# EasyEDA Pro project GEEKS_DEVELOPMENT_BOARD_STM32F4.eprj, schematic Schematic1
Create Date: 2024-09-11; Page Name: P1; Project Name: GEEKS_DEVELOPMENT_BOARD_STM32F4; Schematic Name: Schematic1; Update Date: 2024-10-01; Company: 嘉立创EDA; Page Size: A4; Version: V1.0
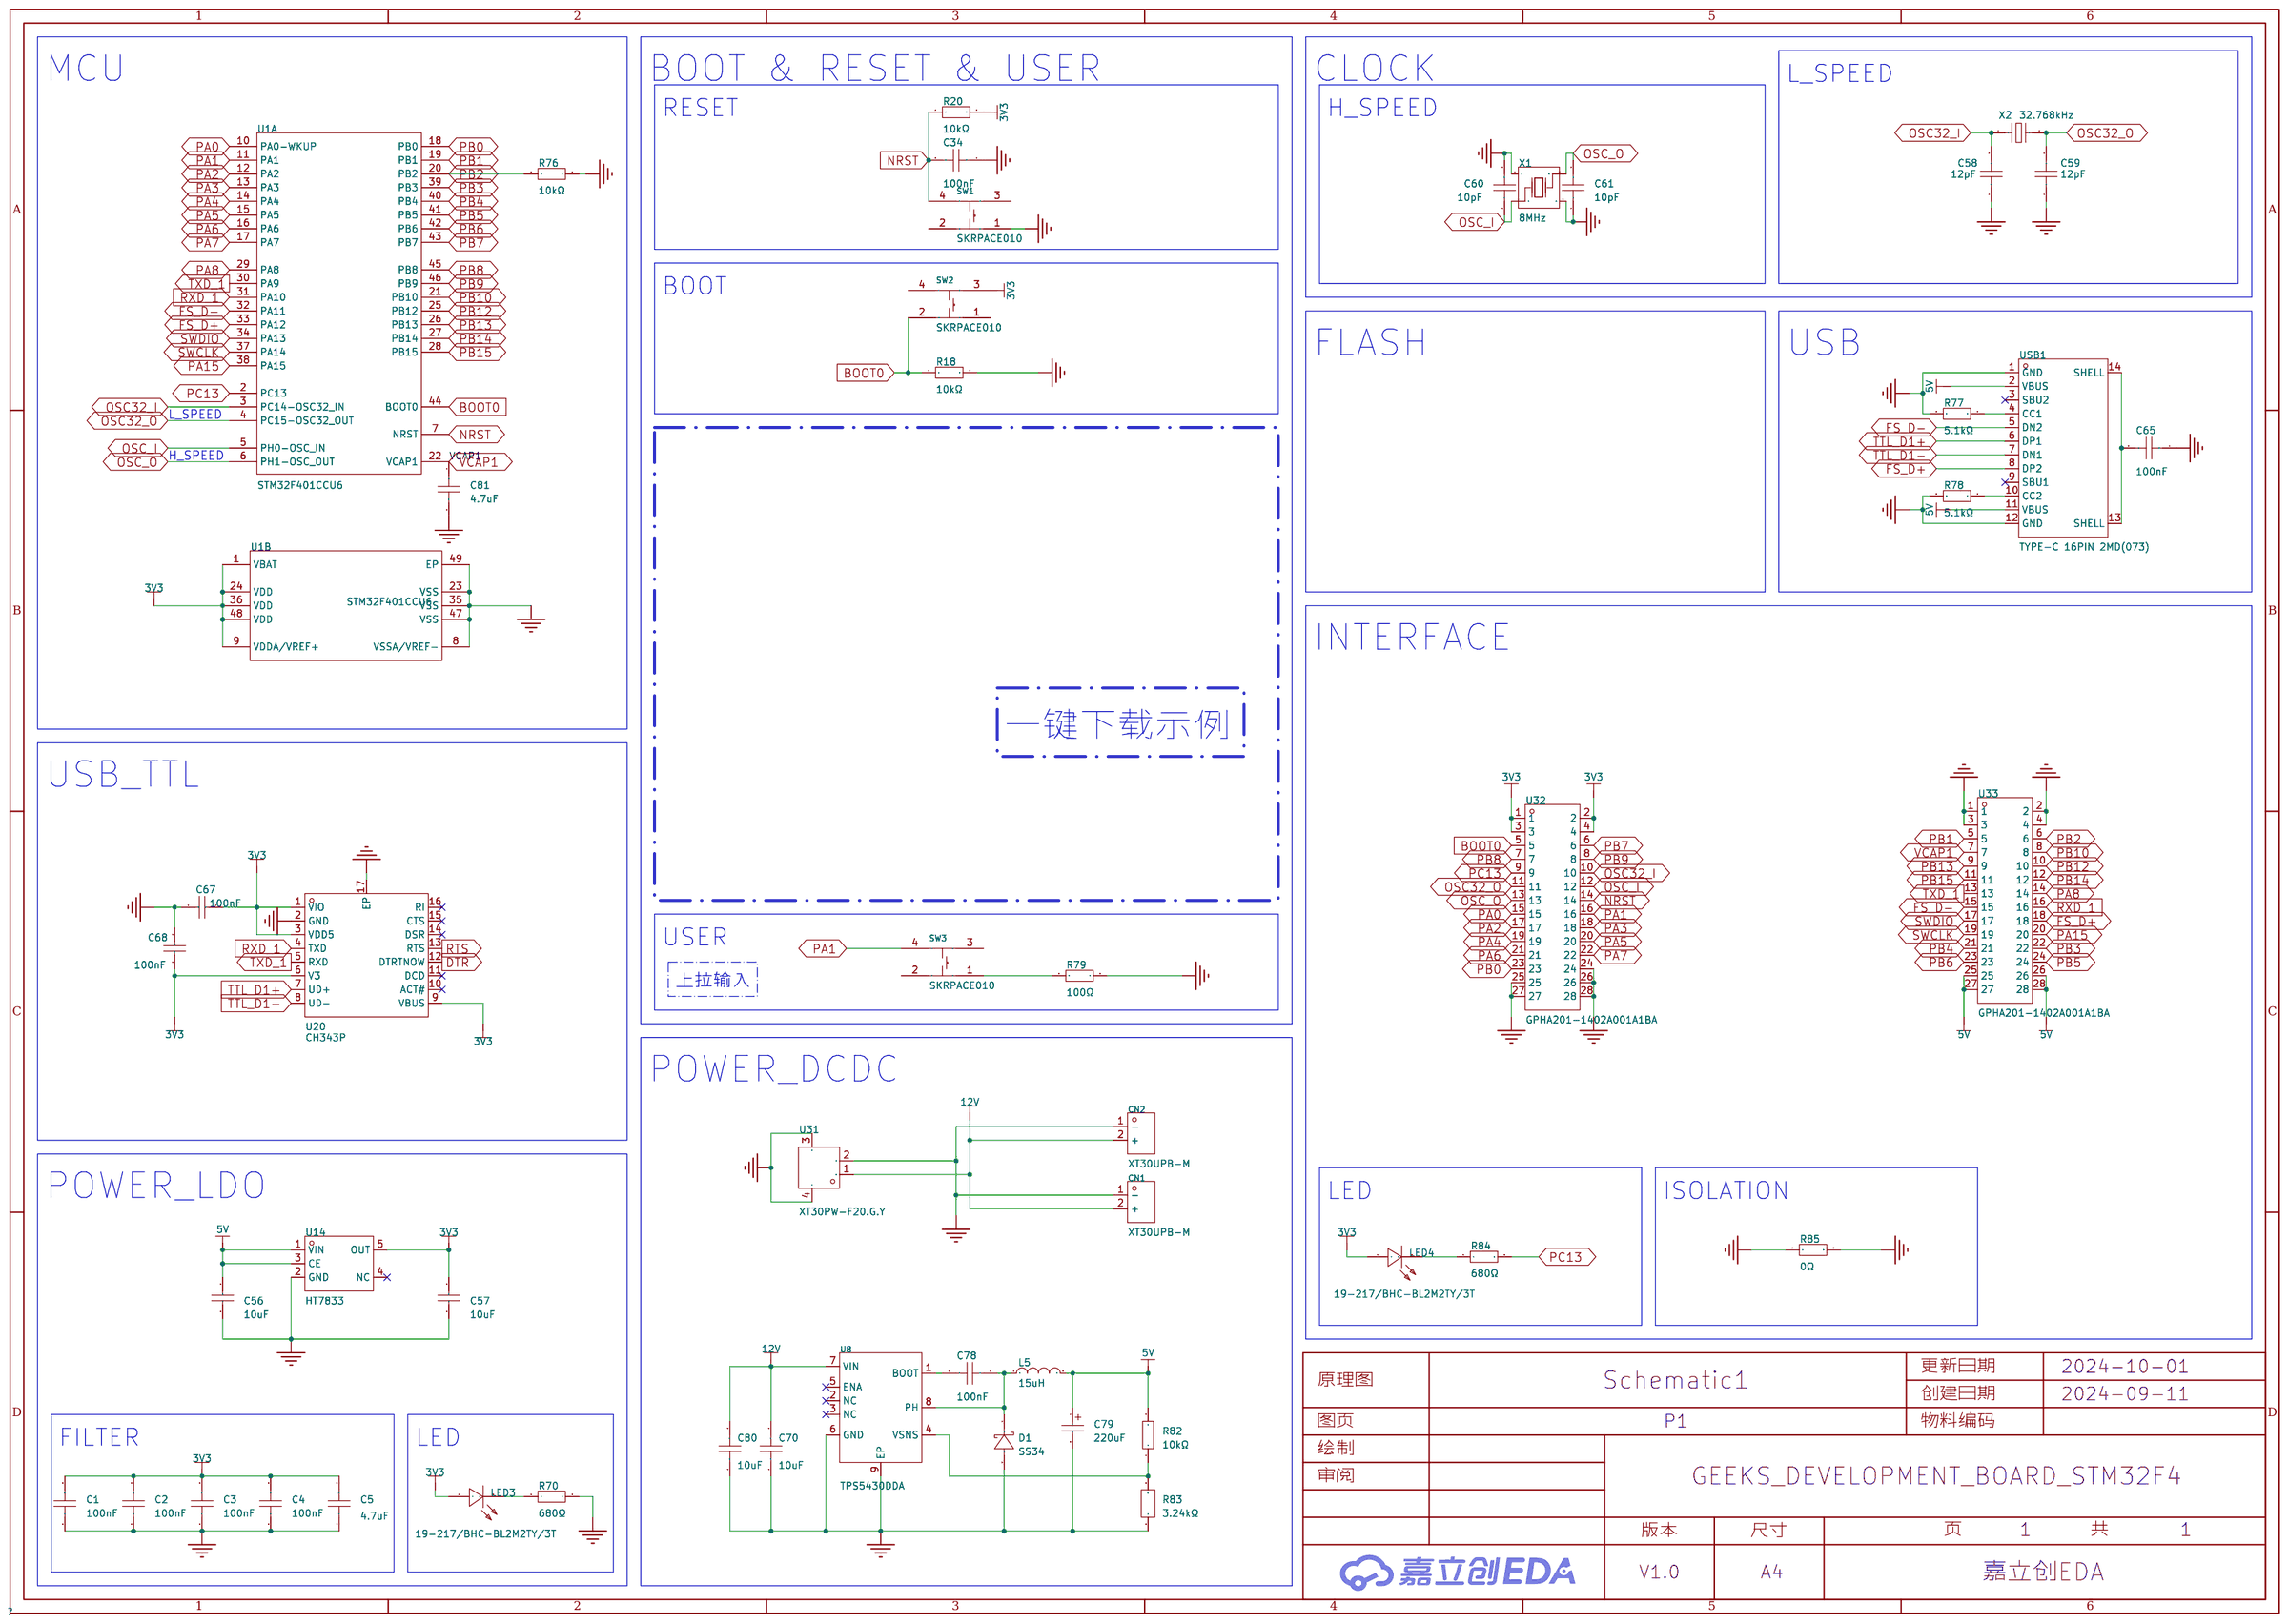
[diagram p0: schematic sheet]

## Parts
C1  100nF  [C0402]
C2  100nF  [C0402]
C3  100nF  [C0402]
C4  100nF  [C0402]
C5  4.7uF  [C0402]
C34  100nF  [C0402]
C56  10uF  [C0402]
C57  10uF  [C0402]
C58  12pF  [C0402]
C59  12pF  [C0402]
C60  10pF  [C0402]
C61  10pF  [C0402]
C65  100nF  [C0402]
C67  100nF  [C0603]
C68  100nF  [C0603]
C70  10uF  [C0603]
C78  100nF  [C0603]
C79  220uF  [CASE-B_3528]
C80  10uF  [C0603]
C81  4.7uF  [C0402]
CN1  XT30UPB-M  [CONN-TH_XT30UPB-M]
CN2  XT30UPB-M  [CONN-TH_XT30UPB-M]
D1  SS34  [SMA_L4.3-W2.5-LS5.0-RD]
L5  15uH  [IND-SMD_L4.6-W4.2_SMMS0420]
LED3  19-217/BHC-BL2M2TY/3T  [LED0603-R-RD_BLUE]
LED4  19-217/BHC-BL2M2TY/3T  [LED0603-R-RD_BLUE]
R18  10kΩ  [R0402]
R20  10kΩ  [R0402]
R70  680Ω  [R0402]
R76  10kΩ  [R0402]
R77  5.1kΩ  [R0402]
R78  5.1kΩ  [R0402]
R79  100Ω  [R0402]
R82  10kΩ  [R0402]
R83  3.24kΩ  [R0402]
R84  680Ω  [R0402]
R85  0Ω  [R0402]
SW1  SKRPACE010  [KEY-SMD_4P-L4.2-W3.2-P2.20-LS4.6]
SW2  SKRPACE010  [KEY-SMD_4P-L4.2-W3.2-P2.20-LS4.6]
SW3  SKRPACE010  [KEY-SMD_4P-L4.2-W3.2-P2.20-LS4.6]
U1  STM32F401CCU6  [UFQFPN-48_L7.0-W7.0-P0.50-BL-EP]  (sections 1,2)
U8  TPS5430DDA  [ESOP-8_L4.9-W3.9-P1.27-LS6.0-BL-EP-2]
U14  HT7833  [SOT-23-5_L2.9-W1.6-P0.95-LS2.8-BL]
U20  CH343P  [TQFN-16_L3.0-W3.0-P0.50-BL-EP1.7]
U31  XT30PW-F20.G.Y  [CONN-TH_XT30PW-F-1]
U32  GPHA201-1402A001A1BA  [HDR-TH_28P-P2.54-V-M-R2-C14-S2.54]
U33  GPHA201-1402A001A1BA  [HDR-TH_28P-P2.54-V-M-R2-C14-S2.54]
USB1  TYPE-C 16PIN 2MD(073)  [USB-C-SMD_TYPE-C-6PIN-2MD-073]
X1  8MHz  [OSC-SMD_4P-L3.2-W2.5-BL]
X2  32.768kHz  [OSC-SMD_L3.2-W1.5]

## Library data of the parts
C1-C4 C65 = GRM155R71H104KE14D: 容值:100nF;精度:±10%;额定电压:50V;材质(温度系数):X7R;; LCSC Part Name: 100nF ±10% 50V; Supplier Part: C77020; Manufacturer: muRata(村田); Supplier Footprint: 0402; JLCPCB Part Class: 扩展库; Datasheet: https://atta.szlcsc.com/upload/public/pdf/source/20180326/C77020_39BD49C951FF1AF0DB1F1FAC5AC1E401.pdf; Supplier: LCSC; Tolerance: ±10%; Voltage Rated: 50V; Temperature Coefficient: X7R
C5 C81 = CL05A475MQ5NRNC: 容值:4.7uF;精度:±20%;额定电压:6.3V;材质(温度系数):X5R;; LCSC Part Name: 4.7uF ±20% 6.3V; Supplier Part: C307423; Manufacturer: SAMSUNG(三星); Supplier Footprint: 0402; JLCPCB Part Class: 扩展库; Datasheet: https://atta.szlcsc.com/upload/public/pdf/source/20181010/C307423_0E0C4E35F3A09F81C2E5C84E00499E42.pdf; Supplier: LCSC; Tolerance: ±20%; Voltage Rated: 6.3V; Temperature Coefficient: X5R
C34 = CC0402JRX7R7BB104: 容值:100nF;精度:±5%;额定电压:16V;材质(温度系数):X7R;; LCSC Part Name: 100nF ±5% 16V; Supplier Part: C541464; Manufacturer: YAGEO(国巨); Supplier Footprint: 0402; JLCPCB Part Class: 扩展库; Datasheet: https://atta.szlcsc.com/upload/public/pdf/source/20200615/C541464_B57AABC9570B6B2CE091E735F96B12C0.pdf; Supplier: LCSC; Tolerance: ±5%; Voltage Rated: 16V; Temperature Coefficient: X7R
C56 C57 = CL05A106MQ5NUNC: 容值:10uF;精度:±20%;额定电压:6.3V;材质(温度系数):X5R;; LCSC Part Name: 10uF ±20% 6.3V; Supplier Part: C15525; Manufacturer: SAMSUNG(三星); Supplier Footprint: 0402; JLCPCB Part Class: 基础库; Datasheet: https://atta.szlcsc.com/upload/public/pdf/source/20220823/2B02EE04F8F211D38A52DCB16EB6BEBA.pdf; Supplier: LCSC; Tolerance: ±20%; Voltage Rated: 6.3V; Temperature Coefficient: X5R
C58 C59 = GCM1555C1H120FA16D: 容值:12pF;精度:±1%;额定电压:50V;材质(温度系数):C0G;; LCSC Part Name: 12pF ±1% 50V; Supplier Part: C393682; Manufacturer: muRata(村田); Supplier Footprint: 0402; JLCPCB Part Class: 扩展库; Datasheet: https://atta.szlcsc.com/upload/public/pdf/source/20190516/C393682_2405B7553F1D74F0F214F12B2CF6E34B.pdf; Supplier: LCSC; Tolerance: ±1%; Voltage Rated: 50V; Temperature Coefficient: C0G
C60 C61 = CL05C100JB5NNNC: 容值:10pF;精度:±5%;额定电压:50V;材质(温度系数):C0G;; LCSC Part Name: 10pF ±5% 50V; Supplier Part: C32949; Manufacturer: SAMSUNG(三星); Supplier Footprint: 0402; JLCPCB Part Class: 基础库; Datasheet: https://atta.szlcsc.com/upload/public/pdf/source/20160218/1457707763339.pdf; Supplier: LCSC; Tolerance: ±5%; Voltage Rated: 50V; Temperature Coefficient: C0G
C67 C68 = 0603B104K500NT: 容值:100nF;精度:±10%;额定电压:50V;材质(温度系数):X7R;; LCSC Part Name: 100nF ±10% 50V; Supplier Part: C30926; Manufacturer: FH(风华); Supplier Footprint: 0603; JLCPCB Part Class: 扩展库; Datasheet: https://atta.szlcsc.com/upload/public/pdf/source/20200305/C486355_26A10D38EF8C2A5C37091D0039909270.pdf; Supplier: LCSC; Tolerance: ±10%; Voltage Rated: 50V; Temperature Coefficient: X7R
C70 C80 = CL10A106KP8NNNC: 容值:10uF;精度:±10%;额定电压:10V;材质(温度系数):X5R;; LCSC Part Name: 10uF ±10% 10V; Supplier Part: C19702; Manufacturer: SAMSUNG(三星); Supplier Footprint: 0603; JLCPCB Part Class: 基础库; Datasheet: https://atta.szlcsc.com/upload/public/pdf/source/20160218/1457707763339.pdf; Supplier: LCSC; Tolerance: ±10%; Voltage Rated: 10V; Temperature Coefficient: X5R
C78 = CGA0603X7R104K500JT: 容值:100nF;精度:±10%;额定电压:50V;材质(温度系数):X7R;; LCSC Part Name: 100nF ±10% 50V; Supplier Part: C6119867; Manufacturer: HRE(芯声); Supplier Footprint: 0603; JLCPCB Part Class: 扩展库; Supplier: LCSC; Tolerance: ±10%; Voltage Rated: 50V; Temperature Coefficient: X7R
C79 = TLJB227M006R0500: 容值:220uF;精度:±20%;额定电压:6.3V;等效串联电阻:500mΩ@100kHz;; LCSC Part Name: 220uF ±20% 6.3V; Supplier Part: C30242; Manufacturer: Kyocera AVX; Supplier Footprint: CASE-B-3528; JLCPCB Part Class: 扩展库; Datasheet: https://atta.szlcsc.com/upload/public/pdf/source/20181016/C313517_95E099C94D57B8A6005DAF15C3058A23.pdf; Supplier: LCSC; Tolerance: ±20%; Rated Voltage: 6.3V; Equivalent Series Resistance(ESR): 500mΩ@100kHz; Operating Temperature: -55℃~+125℃
CN1 CN2 = XT30UPB-M: 类别:-;类型1:-;; LCSC Part Name: AMASS(艾迈斯)板载立式 航模锂电池控制器连接器插头 公头XT30UPB-M; Supplier Part: C428721; Manufacturer: AMASS(艾迈斯); JLCPCB Part Class: 扩展库; Datasheet: https://atta.szlcsc.com/upload/public/pdf/source/20230412/7B5DFEF57C9EA5273853390C734B3AC5.pdf; Supplier: LCSC; Brand: 艾迈斯; Type: 航模插头; Colour: 黄色; RatedVoltage: DC 500V; InterfaceType: 公头; MetalMaterial: 镀金; InsulationMaterial: PA; RatedCurrent: 15A; contact resistance: 0.65mΩ
D1 = SS34_C727060: 二极管配置:独立式;正向压降(Vf):550mV@3A;直流反向耐压(Vr):40V;平均整流电流(Io):3A;; LCSC Part Name: 电压:40V 电流:3A; Supplier Part: C727060; Manufacturer: TWGMC(台湾迪嘉); Supplier Footprint: SMA(DO-214AC); JLCPCB Part Class: 扩展库; Datasheet: https://atta.szlcsc.com/upload/public/pdf/source/20200828/C727059_6599B6CAC5F3238B9C33E46794659DBE.pdf; Supplier: LCSC; Diode Configuration: 独立式; Forward Voltage (Vf@If): 550mV@3A; Reverse Voltage (Vr): 40V; Average Rectified Current (Io): 3A; Reverse Leakage Current (Ir): 500uA@40V
L5 = SMMS0420-150M: 电感值:15uH;精度:±20%;额定电流:1.4A;饱和电流(Isat):1.9A;类型:一体成型电感;; LCSC Part Name: 15uH ±20% 1.9A; Supplier Part: C2894719; Manufacturer: SXN(顺翔诺); Supplier Footprint: SMD,4.6x4.2x2mm; JLCPCB Part Class: 扩展库; Datasheet: https://atta.szlcsc.com/upload/public/pdf/source/20210910/523B6BB0C4A09F37806A127B1ABE761D.pdf; Supplier: LCSC; Tolerance: ±20%; Rated Current: 1.4A; Saturation Current (Isat): 1.9A; DC Resistance (DCR): 320mΩ; Type: 一体成型电感
LED3 LED4 = 19-217/BHC-BL2M2TY/3T: 发光颜色:蓝灯;; LCSC Part Name: 蓝灯; Supplier Part: C264471; Manufacturer: EVERLIGHT(亿光); Supplier Footprint: 0603; Datasheet: https://atta.szlcsc.com/upload/public/pdf/source/20190115/C264471_53BC758422C9CC53D26B857C95585990.pdf; Supplier: LCSC; Emitted Color: 蓝灯
R18 R20 = RC0402FR-0710KL: 电阻类型:厚膜电阻;阻值:10kΩ;精度:±1%;功率:62.5mW;; LCSC Part Name: 10kΩ ±1% 62.5mW; Supplier Part: C60490; Manufacturer: YAGEO(国巨); Supplier Footprint: 0402; JLCPCB Part Class: 扩展库; Datasheet: https://atta.szlcsc.com/upload/public/pdf/source/20170606/1496716515432.pdf; Supplier: LCSC; Type: 厚膜电阻; Tolerance: ±1%; Power(Watts): 62.5mW; Overload Voltage (Max): 50V; Temperature Coefficient: ±100ppm/℃; Operating Temperature Range: -55℃~+155℃
R70 R84 = 0402WGF6800TCE: 电阻类型:厚膜电阻;阻值:680Ω;精度:±1%;功率:62.5mW;最大工作电压:50V;温度系数:±100ppm/℃;; LCSC Part Name: 680Ω ±1% 62.5mW 厚膜电阻; Supplier Part: C25130; Manufacturer: UNI-ROYAL(厚声); Supplier Footprint: 0402; JLCPCB Part Class: 扩展库; Datasheet: https://atta.szlcsc.com/upload/public/pdf/source/20200306/C422600_1E6D84923E4A46A82E41ADD87F860B5C.pdf; Supplier: LCSC; Type: 厚膜电阻; Tolerance: ±1%; Power(Watts): 62.5mW; Overload Voltage (Max): 50V; Temperature Coefficient: ±100ppm/℃; Operating Temperature Range: -55℃~+155℃
R76 = RC0402FR-0710KL: 电阻类型:厚膜电阻;阻值:10kΩ;精度:±1%;功率:62.5mW;最大工作电压:50V;温度系数:±100ppm/℃;; LCSC Part Name: 厚膜电阻 10kΩ ±1% 62.5mW; Supplier Part: C60490; Manufacturer: YAGEO(国巨); Supplier Footprint: 0402; JLCPCB Part Class: 扩展库; Datasheet: https://atta.szlcsc.com/upload/public/pdf/source/20170925/C131467_1506321478108990263.pdf; Supplier: LCSC; Type: 厚膜电阻; Tolerance: ±1%; Power(Watts): 62.5mW; Overload Voltage (Max): 50V; Temperature Coefficient: ±100ppm/℃; Operating Temperature Range: -55℃~+155℃
R77 R78 = 0402WGF5101TCE: 电阻类型:厚膜电阻;阻值:5.1kΩ;精度:±1%;功率:62.5mW;最大工作电压:50V;温度系数:±100ppm/℃;; LCSC Part Name: 5.1kΩ ±1% 62.5mW 厚膜电阻; Supplier Part: C25905; Manufacturer: UNI-ROYAL(厚声); Supplier Footprint: 0402; JLCPCB Part Class: 基础库; Datasheet: https://atta.szlcsc.com/upload/public/pdf/source/20200306/C422600_1E6D84923E4A46A82E41ADD87F860B5C.pdf; Supplier: LCSC; Type: 厚膜电阻; Tolerance: ±1%; Power(Watts): 62.5mW; Overload Voltage (Max): 50V; Temperature Coefficient: ±100ppm/℃; Operating Temperature Range: -55℃~+155℃
R79 = 0402WGJ0101TCE: 电阻类型:厚膜电阻;阻值:100Ω;精度:±5%;功率:62.5mW;最大工作电压:50V;温度系数:±100ppm/℃;; LCSC Part Name: 100Ω ±5% 62.5mW 厚膜电阻; Supplier Part: C25138; Manufacturer: UNI-ROYAL(厚声); Supplier Footprint: 0402; JLCPCB Part Class: 扩展库; Datasheet: https://atta.szlcsc.com/upload/public/pdf/source/20200306/C422600_1E6D84923E4A46A82E41ADD87F860B5C.pdf; Supplier: LCSC; Type: 厚膜电阻; Tolerance: ±5%; Power(Watts): 62.5mW; Overload Voltage (Max): 50V; Temperature Coefficient: ±100ppm/℃; Operating Temperature Range: -55℃~+155℃
R82 = 0402WGF1002TCE: 电阻类型:厚膜电阻;阻值:10kΩ;精度:±1%;功率:62.5mW;最大工作电压:50V;温度系数:±100ppm/℃;; LCSC Part Name: 10kΩ ±1% 62.5mW 厚膜电阻; Supplier Part: C25744; Manufacturer: UNI-ROYAL(厚声); Supplier Footprint: 0402; JLCPCB Part Class: 基础库; Datasheet: https://atta.szlcsc.com/upload/public/pdf/source/20200306/C422600_1E6D84923E4A46A82E41ADD87F860B5C.pdf; Supplier: LCSC; Type: 厚膜电阻; Tolerance: ±1%; Power(Watts): 62.5mW; Overload Voltage (Max): 50V; Temperature Coefficient: ±100ppm/℃; Operating Temperature Range: -55℃~+155℃
R83 = PTFR0402B3K24N9: 电阻类型:薄膜电阻;阻值:3.24kΩ;精度:±0.1%;功率:60mW;最大工作电压:75V;温度系数:±10ppm/℃;; LCSC Part Name: 薄膜电阻 3.24kΩ ±0.1% 60mW; Supplier Part: C2692977; Manufacturer: RESI(开步睿思); Supplier Footprint: 0402; JLCPCB Part Class: 扩展库; Datasheet: https://atta.szlcsc.com/upload/public/pdf/source/20240506/11BDC7478D84177AC2A5326A65B6EB29.pdf; Supplier: LCSC; Type: 薄膜电阻; Tolerance: ±0.1%; Power(Watts): 60mW; Overload Voltage (Max): 75V; Temperature Coefficient: ±10ppm/℃; Operating Temperature Range: -55℃~+125℃
R85 = 0402WGF0000TCE: 电阻类型:厚膜电阻;阻值:0Ω;精度:±1%;功率:62.5mW;最大工作电压:50V;温度系数:±800ppm/℃;; LCSC Part Name: 0Ω ±1% 62.5mW 厚膜电阻; Supplier Part: C17168; Manufacturer: UNI-ROYAL(厚声); Supplier Footprint: 0402; JLCPCB Part Class: 基础库; Datasheet: https://atta.szlcsc.com/upload/public/pdf/source/20200306/C422600_1E6D84923E4A46A82E41ADD87F860B5C.pdf; Supplier: LCSC; Type: 厚膜电阻; Tolerance: ±1%; Power(Watts): 62.5mW; Overload Voltage (Max): 50V; Temperature Coefficient: ±800ppm/℃; Operating Temperature Range: -55℃~+155℃
SW1-SW3 = SKRPACE010: 电路结构:单刀单掷;按钮形状:椭圆形按钮;安装方式:立贴;开关长度:4.2mm;开关宽度:3.2mm;开关高度:2.5mm;触点电流:50mA;额定电压(DC):16V;带灯:-;机械寿命:-;; LCSC Part Name: 4.2*3.2*2.5mm 立贴 轻触开关; Supplier Part: C139797; Manufacturer: ALPSALPINE(阿尔卑斯阿尔派); Supplier Footprint: SMD; JLCPCB Part Class: 扩展库; Datasheet: https://atta.szlcsc.com/upload/public/pdf/source/20171113/C139797_15105612676371115729.pdf; Supplier: LCSC; Circuit: 单刀单掷; Actuator Style: 椭圆形按钮; Mounting Style: 立贴; Switch Length: 4.2mm; Switch Width: 3.2mm; Switch Height: 2.5mm; Contact Current: 50mA; Voltage Rating (DC): 16V
U1 = STM32F401CCU6: CPU内核:ARM-M4;程序存储容量:256KB;RAM总容量:64KB;GPIO端口数量:36;工作电压范围:1.7V~3.6V;CPU最大主频:84MHz;程序存储器类型:FLASH;; LCSC Part Name: 带DSP和FPU的高性能基本型系列ARM Cortex-M4 MCU，具有256 KB Flash、84 MHz CPU和ART加速器; Supplier Part: C79861; Manufacturer: ST(意法半导体); Supplier Footprint: UFQFPN-48(7x7); JLCPCB Part Class: 扩展库; Datasheet: https://atta.szlcsc.com/upload/public/pdf/source/20160816/1471343009422.pdf; Supplier: LCSC; CPU Core: ARM-M4; Program Storage Size: 256KB; RAM Size: 64KB; GPIO Ports Number: 36; Operating Voltage Range: 1.7V~3.6V; CPU Maximum Speed: 84MHz; Program Memory Type: FLASH; Operating Temperature Range: -40℃~+85℃; ADC (Bit): 12bit; Universal Serial Bus: 有; Peripheral/Function: PWM；PWM; Secure Digital Input and Output: 有; Internal Oscillator: 有
U8 = TPS5430DDA: 功能类型:降压型;输出类型:可调;输入电压:5.5V~36V;输出电压:1.221V~32.04V;输出电流(最大值):3A;; Supplier Part: C502477; Manufacturer: TI(德州仪器); Supplier Footprint: SOP-8-EP; JLCPCB Part Class: 扩展库; Datasheet: https://www.ti.com/cn/lit/gpn/tps5430; Supplier: LCSC; Function: 降压型; Synchronous Rectification: 否; Output Type: 可调; Number of Outputs: 1; Topology: 降压式; Input Voltage: 5.5V~36V; Output Voltage: 1.221V~32.04V; Output Current (Max): 3A; Switching Frequency: 500kHz; Operating Temperature: -40℃~+125℃@(TJ)
U14 = HT7833_C3011187: LCSC Part Name: 500mA 2uA Hight PSRR Voltage Regulator; Supplier Part: C3011187; Manufacturer: TECH PUBLIC(台舟); Supplier Footprint: SOT-23-5; JLCPCB Part Class: 扩展库; Datasheet: https://atta.szlcsc.com/upload/public/pdf/source/20220511/52D8A72EC3CBC44D368221752E30E118.pdf; Supplier: LCSC
U20 = CH343P: 应用功能:-;接口协议:-;; Supplier Part: C2846043; Manufacturer: WCH(南京沁恒); Supplier Footprint: TQFN-16-EP(3x3); JLCPCB Part Class: 扩展库; Datasheet: https://atta.szlcsc.com/upload/public/pdf/source/20211010/C2846043_7FA705E1F14A2906F6A2AFA45FA28209.pdf; Supplier: LCSC
U31 = XT30PW-F20.G.Y: 类别:-;类型1:-;; LCSC Part Name: AMASS(艾迈斯)电源连接器 母头 XT30PW-F; Supplier Part: C2913282; Manufacturer: AMASS(艾迈斯); JLCPCB Part Class: 扩展库; Datasheet: https://atta.szlcsc.com/upload/public/pdf/source/20231218/06CFCF98887A9A87638B0856A725C8FD.pdf; Supplier: LCSC; Type: 航模插头; InterfaceType: 母头
U32 U33 = GPHA201-1402A001A1BA: 插针结构:2x14P;间距:2.54mm;行距:2.54mm;圆针/方针:方针;安装类型:直插;排数:双排;总PIN位数:28P;额定电流:3A;工作温度范围:-40℃~+105℃;; LCSC Part Name: 2x14P 间距:2.54mm 方针 直插; Supplier Part: C7434507; Manufacturer: GREENCONN(格康); Supplier Footprint: 插件,P=2.54mm; JLCPCB Part Class: 扩展库; Datasheet: https://atta.szlcsc.com/upload/public/pdf/source/20230629/613DF7C618537BFD465DA32CACFAE383.pdf; Supplier: LCSC; Pin Structure: 2x14P; Pitch: 2.54mm; Row Spacing: 2.54mm; Circluar Pins/Square Pins: 方针; Mounting Type: 直插; Number of Rows: 双排; Number of Pins: 28P; Current Rating (Max): 3A; Operating Temperature Range: -40℃~+105℃
USB1 = TYPE-C 16PIN 2MD(073): 连接器类型:Type-C;标准:USB 3.1;公母:母;安装方式:卧贴;触点数量:16P;端口数量:1;额定电流 - 电源:5A;工作温度范围:-25℃~+85℃;; LCSC Part Name: Type-C 母 卧贴; Supplier Part: C2765186; Manufacturer: SHOU HAN(首韩); Supplier Footprint: SMD; JLCPCB Part Class: 扩展库; Datasheet: https://atta.szlcsc.com/upload/public/pdf/source/20211123/39B17C16241EAC15C5E277BDA434118E.pdf; Supplier: LCSC; Connector Type: Type-C; Standard: USB 3.1; Gender: 母; Mounting Style: 卧贴; Number of Contacts: 16P; Number of Ports: 1; Current Rating - Power (Max): 5A; Operating Temperature Range: -25℃~+85℃; Rated Voltage (Max): 5V; Connect-Disconnect Life: 5千次; Core Colour: 黑色
X1 = TAXM8M4RDBCCT2T: 晶振类型:贴片晶振;频率:8MHz;常温频差:±10ppm;外接负载电容:10pF;频率稳定度(全温):±15ppm;; LCSC Part Name: 8MHz ±10ppm 10pF; Supplier Part: C400090; Manufacturer: YJX(雅晶鑫); Supplier Footprint: SMD3225-4P; JLCPCB Part Class: 扩展库; Datasheet: https://atta.szlcsc.com/upload/public/pdf/source/20190626/C400090_CF95B89E745AFE4EF2E392EF8AC009D6.pdf; Supplier: LCSC; Crystal Type: 贴片晶振; Normal temperature Frequency Tolerance: ±10ppm; External load capacitor: 10pF; Frequency Stability(Full temperature range): ±15ppm; Equivalent Series Resistance (ESR): 250Ω; Operating Temperature: -40℃~+85℃
X2 = X321532768KGD2SI: 晶振类型:贴片晶振;频率:32.768kHz;常温频差:±20ppm;外接负载电容:12.5pF;频率稳定度(全温):-;; LCSC Part Name: 32.768kHz ±20ppm 12.5pF; Supplier Part: C620155; Manufacturer: YXC(扬兴晶振); Supplier Footprint: SMD3215-2P; JLCPCB Part Class: 扩展库; Datasheet: https://atta.szlcsc.com/upload/public/pdf/source/20240329/3A7650FD985DD0DE85694D3785AB4916.pdf; Supplier: LCSC; Crystal Type: 贴片晶振; Normal temperature Frequency Tolerance: ±20ppm; External load capacitor: 12.5pF; Operating Temperature: -40℃~+85℃

## Nets
3V3: C1.2 C2.2 C3.2 C4.2 C5.2 C57.2 C67.2 C68.1 LED3.1(A) LED4.1(A) R20.2 SW2.3 U1.1(VBAT) U1.9(VDDA/VREF+) U1.24(VDD) U1.36(VDD) U1.48(VDD) U14.5(OUT) U20.1(VIO) U20.3(VDD5) U20.6(V3) U20.9(VBUS) U32.1 U32.2 U32.3 U32.4
5V: C56.2 C79.1 L5.2 R82.2 U14.1(VIN) U14.3(CE) U33.25 U33.26 U33.27 U33.28 USB1.2(VBUS) USB1.11(VBUS)
12V: C70.2 C80.2 CN1.2(+) CN2.2(+) U8.7(VIN) U31.1
AGND: C70.1 C79.2 C80.1 CN1.1(-) CN2.1(-) D1.2(A) R83.1 R85.2 U8.6(GND) U8.9(EP) U31.2 U31.3 U31.4
GND: C1.1 C2.1 C3.1 C4.1 C5.1 C34.1 C56.1 C57.1 C58.1 C59.1 C60.2 C61.1 C65.1 C67.1 C68.2 C81.2 R18.2 R70.2 R76.2 R77.2 R78.2 R79.1 R85.1 SW1.1 U1.8(VSSA/VREF-) U1.23(VSS) U1.35(VSS) U1.47(VSS) U1.49(EP) U14.2(GND) U20.2(GND) U20.17(EP) U32.24 U32.25 U32.26 U32.27 U32.28 U33.1 U33.2 U33.3 U33.4 USB1.1(GND) USB1.12(GND) X1.2 X1.4
BOOT0: R18.1 SW2.2 U1.44(BOOT0) U32.5
DTR: U20.12(DTRTNOW)
FS_D+: U1.33(PA12) U33.18 USB1.8(DP2)
FS_D-: U1.32(PA11) U33.15 USB1.5(DN2)
NRST: C34.2 R20.1 SW1.4 U1.7(NRST) U32.14
OSC32_I: C58.2 U1.3(PC14-OSC32_IN) U32.10 X2.1
OSC32_O: C59.2 U1.4(PC15-OSC32_OUT) U32.11 X2.2
OSC_I: C60.1 U1.5(PH0-OSC_IN) U32.12 X1.1
OSC_O: C61.2 U1.6(PH1-OSC_OUT) U32.13 X1.3
PA0: U1.10(PA0-WKUP) U32.15
PA1: SW3.4 U1.11(PA1) U32.16
PA2: U1.12(PA2) U32.17
PA3: U1.13(PA3) U32.18
PA4: U1.14(PA4) U32.19
PA5: U1.15(PA5) U32.20
PA6: U1.16(PA6) U32.21
PA7: U1.17(PA7) U32.22
PA8: U1.29(PA8) U33.14
PA15: U1.38(PA15) U33.20
PB0: U1.18(PB0) U32.23
PB1: U1.19(PB1) U33.5
PB2: R76.1 U1.20(PB2) U33.6
PB3: U1.39(PB3) U33.22
PB4: U1.40(PB4) U33.21
PB5: U1.41(PB5) U33.24
PB6: U1.42(PB6) U33.23
PB7: U1.43(PB7) U32.6
PB8: U1.45(PB8) U32.7
PB9: U1.46(PB9) U32.8
PB10: U1.21(PB10) U33.8
PB12: U1.25(PB12) U33.10
PB13: U1.26(PB13) U33.9
PB14: U1.27(PB14) U33.12
PB15: U1.28(PB15) U33.11
PC13: R84.2 U1.2(PC13) U32.9
RTS: U20.13(RTS)
RXD_1: U1.31(PA10) U20.4(TXD) U33.16
SWCLK: U1.37(PA14) U33.19
SWDIO: U1.34(PA13) U33.17
TTL_D1+: U20.7(UD+) USB1.6(DP1)
TTL_D1-: U20.8(UD-) USB1.7(DN1)
TXD_1: U1.30(PA9) U20.5(RXD) U33.13
VCAP1: C81.1 U1.22(VCAP1) U33.7
$1N3260: LED3.2(K) R70.1
$1N6017: C65.2 USB1.13(SHELL) USB1.14(SHELL)
$1N6108: R77.1 USB1.4(CC1)
$1N6111: R78.1 USB1.10(CC2)
$1N27095: C78.1 D1.1(C) L5.1 U8.8(PH)
$1N27260: R82.1 R83.2 U8.4(VSNS)
$1N29436: C78.2 U8.1(BOOT)
$1N49858: LED4.2(K) R84.1
$1N55601: R79.2 SW3.1

Not connected (* = marked no-connect by the designer): SW1 2 3; SW2 1 4; SW3 2 3; U8 2(NC)* 3(NC)* 5(ENA)*; U14 4(NC)*; U20 10(ACT#)* 11(DCD)* 14(DSR)* 15(CTS)* 16(RI)*; USB1 3(SBU2)* 9(SBU1)*

## Notes on the sheet
- MCU
- BOOT & RESET & USER
- CLOCK
- L_SPEED
- RESET
- H_SPEED
- BOOT
- FLASH
- USB
- L_SPEED
- H_SPEED
- INTERFACE
- 一键下载示例
- USB_TTL
- USER
- 上拉输入
- POWER_DCDC
- POWER_LDO
- LED
- ISOLATION
- FILTER
- LED
